# EAGLE design BTLED-01 (EAGLE 9.6.2)
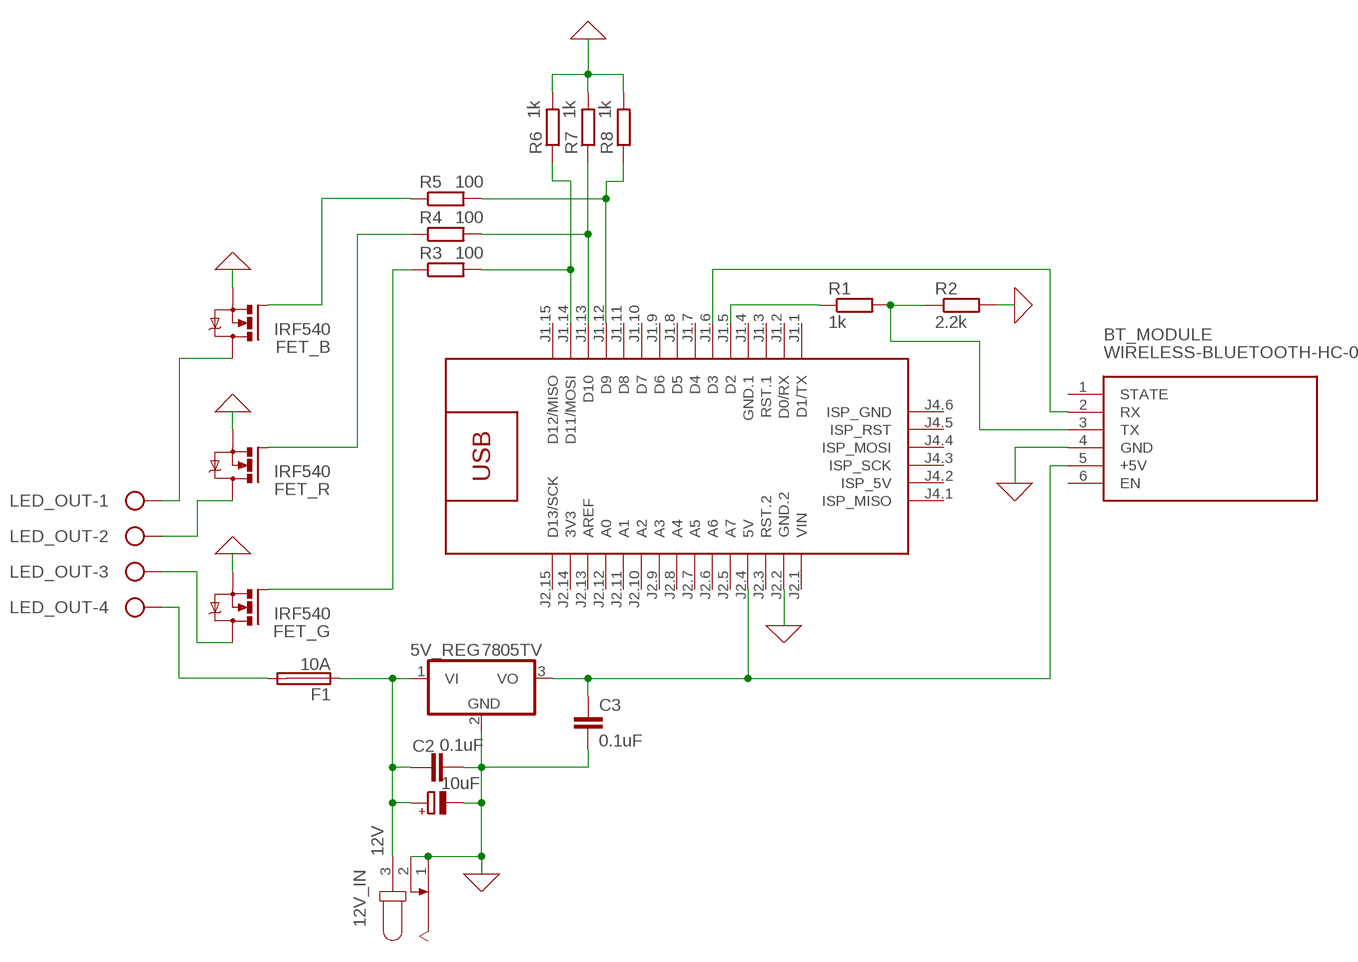
[diagram p0: schematic, sheet 1]

## Parts
5V_REG  7805TV  [TO220V]
12V_IN  12V  JACK-PLUG1  [SPC4078]
ARDUINO_NANO  ARDUINO-NANO-3.0#ISP  [ARDUINO-NANO-3.0#ISP]
BT_MODULE  WIRELESS-BLUETOOTH-HC-05  [WIRELESS-BLUETOOTH-HC-05]
C1  10uF  CPOL-EUE2.5-6  [E2,5-6]
C2  0.1uF  C-EU050-024X044  [C050-024X044]
C3  0.1uF  C-EU050-024X044  [C050-024X044]
F1  10A  SH22,5  [SH22,5]
FET_B  IRF540  [TO220BV]
FET_G  IRF540  [TO220BV]
FET_R  IRF540  [TO220BV]
LED_OUT  W237-4  [W237-4]
R1  1k  R-EU_0204/7  [0204/7]
R2  2.2k  R-EU_0204/7  [0204/7]
R3  100  R-EU_0204/7  [0204/7]
R4  100  R-EU_0204/7  [0204/7]
R5  100  R-EU_0204/7  [0204/7]
R6  1k  R-EU_0204/7  [0204/7]
R7  1k  R-EU_0204/7  [0204/7]
R8  1k  R-EU_0204/7  [0204/7]

## Nets
5V: 5V_REG.3(VO) ARDUINO_NANO.J2.4(5V) BT_MODULE.5(+5V) C3.1
12V_IN: 5V_REG.1(VI) 12V_IN.3 C1.+ C2.1 F1.1
12V_OUT: F1.2 LED_OUT.4
B_DRAIN: FET_B.D LED_OUT.1
B_SIG_1: ARDUINO_NANO.J1.12(D9) R5.2 R8.1
B_SIG_2: FET_B.G R5.1
BT_RX_3.3V: BT_MODULE.3(TX) R1.2 R2.1
BT_RX_5V: ARDUINO_NANO.J1.5(D2) R1.1
BT_TX: ARDUINO_NANO.J1.6(D3) BT_MODULE.2(RX)
G_DRAIN: FET_G.D LED_OUT.3
G_SIG_1: ARDUINO_NANO.J1.14(D11/MOSI) R3.2 R6.1
G_SIG_2: FET_G.G R3.1
GND: 5V_REG.2(GND) 12V_IN.1 12V_IN.2 ARDUINO_NANO.J2.2(GND.2) BT_MODULE.4(GND) C1.- C2.2 C3.2 FET_B.S FET_G.S FET_R.S R2.2 R6.2 R7.2 R8.2
R_DRAIN: FET_R.D LED_OUT.2
R_SIG_1: ARDUINO_NANO.J1.13(D10) R4.2 R7.1
R_SIG_2: FET_R.G R4.1
Unconnected: ARDUINO_NANO.J1.1(D1/TX) ARDUINO_NANO.J1.2(D0/RX) ARDUINO_NANO.J1.3(RST.1) ARDUINO_NANO.J1.7(D4) ARDUINO_NANO.J1.8(D5) ARDUINO_NANO.J1.9(D6) ARDUINO_NANO.J1.10(D7) ARDUINO_NANO.J1.11(D8) ARDUINO_NANO.J1.15(D12/MISO) ARDUINO_NANO.J2.3(RST.2) ARDUINO_NANO.J2.5(A7) ARDUINO_NANO.J2.6(A6) ARDUINO_NANO.J2.7(A5) ARDUINO_NANO.J2.8(A4) ARDUINO_NANO.J2.9(A3) ARDUINO_NANO.J2.10(A2) ARDUINO_NANO.J2.11(A1) ARDUINO_NANO.J2.12(A0) ARDUINO_NANO.J2.13(AREF) ARDUINO_NANO.J2.15(D13/SCK) ARDUINO_NANO.J4.1(ISP_MISO) ARDUINO_NANO.J4.2(ISP_5V) ARDUINO_NANO.J4.3(ISP_SCK) ARDUINO_NANO.J4.4(ISP_MOSI) ARDUINO_NANO.J4.5(ISP_RST) ARDUINO_NANO.J4.6(ISP_GND) BT_MODULE.1(STATE) BT_MODULE.6(EN)

## Power pins joined to a net without a drawn wire
3V3: ARDUINO_NANO.J2.14(3V3)
GND.1: ARDUINO_NANO.J1.4(GND.1)
VIN: ARDUINO_NANO.J2.1(VIN)

## Library data of the parts
5V_REG = linear:78*: Positive VOLTAGE REGULATOR Source: http://cache.national.com/ds/LM/LM78L05.pdf http://www.fairchildsemi.com/ds/LM/LM7805.pdf
12V_IN = con-jack:JACK-PLUG: DC POWER JACK Power Jack, DC, Right Angle, Through Hole, Rated 5A at 16VDC, PC Terminals Distributor: Farnell (www.Farnell.de) Drawing: 84N1161.pdf / 84N1162.pdf Manufacturer: SPC Technology (www.spctechnology.com) Type: SPC4077 / SPC 4078; OC_FARNELL: unknown; OC_NEWARK: unknown
ARDUINO_NANO = diy-modules:ARDUINO-NANO-3.0#ISP: Arduino Nano 3.0 (and compatible devices) with ISP pads More details available here: https://www.arduino.cc/en/Main/ArduinoBoardNano Click here to find device on ebay.com <http://www.ebay.com/sch/arduino+nano>
BT_MODULE = diy-modules:WIRELESS-BLUETOOTH-HC-05: Bluetooth Transceiver Module based on HC-05 board Tutorial is available here: https://arduino-info.wikispaces.com/BlueTooth-HC05-HC06-Modules-How-To Click here to find device on ebay.com <http://www.ebay.com/sch/hc-05+module+rs232>
C1 = rcl:CPOL-EU: POLARIZED CAPACITOR, European symbol; SPICEPREFIX: C
C2 C3 = rcl:C-EU: CAPACITOR, European symbol; SPICEPREFIX: C
F1 = fuse:SH22,5: FUSE HOLDER grid 22,5 mm, OGN0031 8201, Schurter (Buerklin); MF: SCHURTER; MPN: 0031.8201; OC_FARNELL: 1162740; OC_NEWARK: 96F8317
FET_B FET_G FET_R = transistor-power:IRF540: HEXFET Power MOSFET
LED_OUT = con-wago-500:W237-4: WAGO SCREW CLAMP; OC_FARNELL: unknown; OC_NEWARK: unknown
R1-R8 = rcl:R-EU_: RESISTOR, European symbol; SPICEPREFIX: R

## Net classes
0 default: width 0.305 mm, drill 0.61 mm, clearance 0.152 mm

## Board
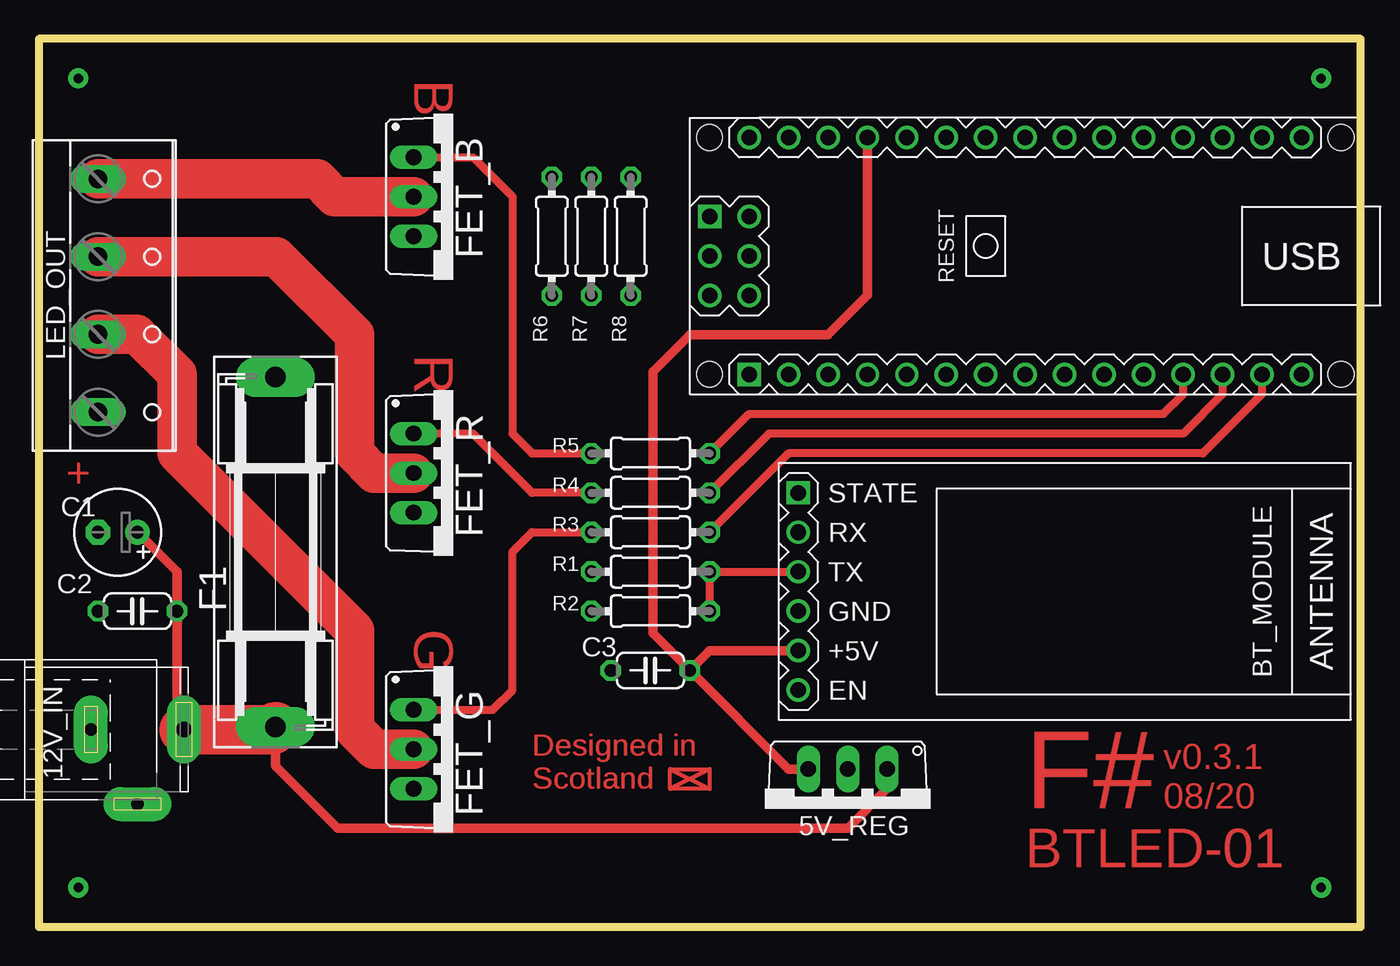
[diagram p1: board, top side]
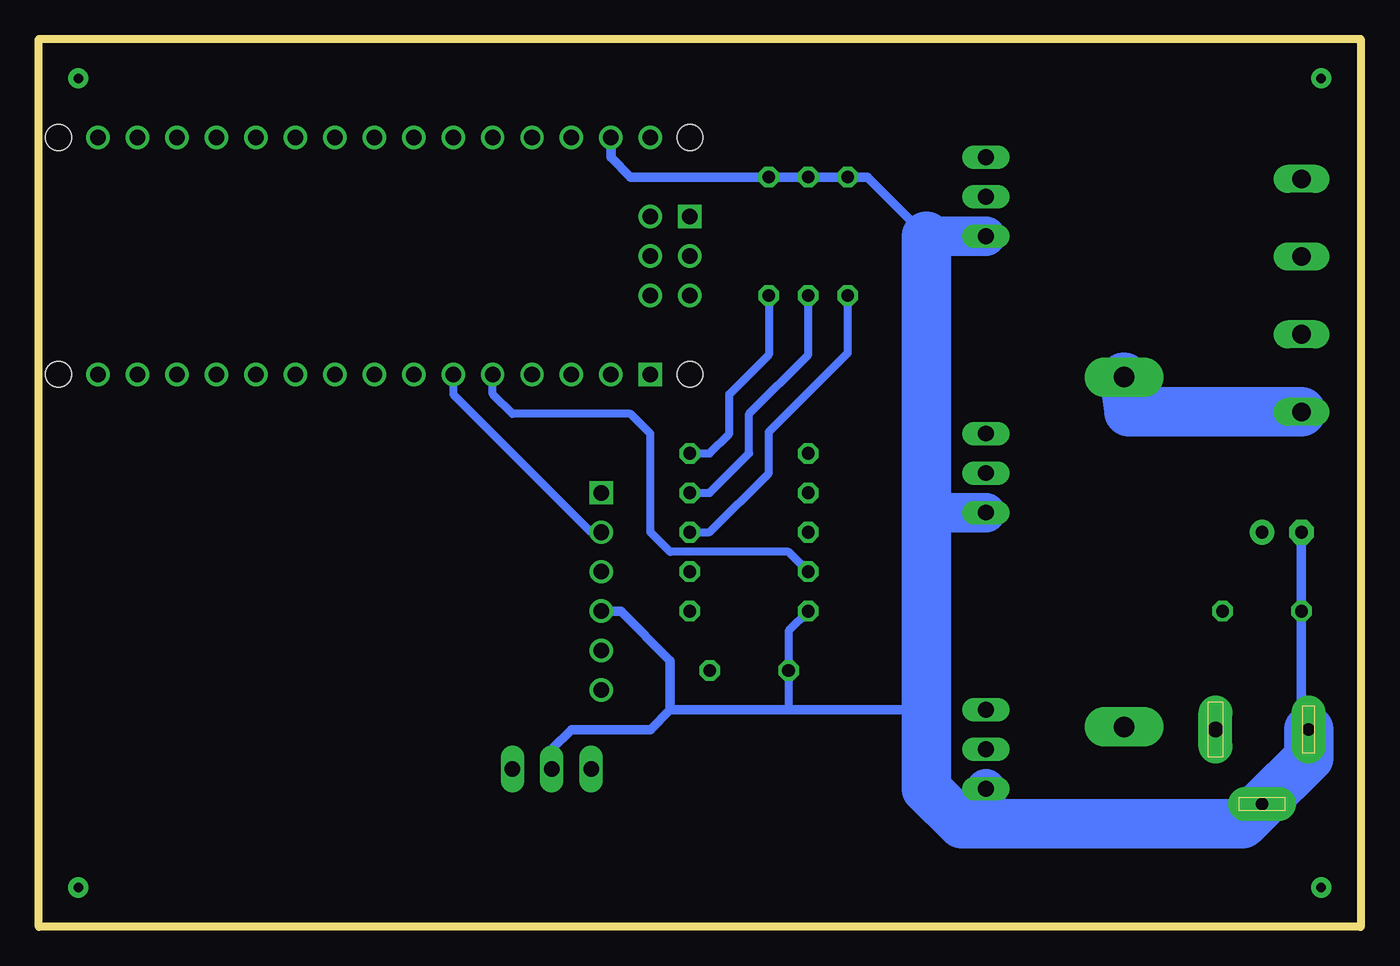
[diagram p2: board, bottom side, seen from below]

Size 85.09 x 57.15 mm. Coordinates in mm from the lower left corner, seen from the top.
Outline: 0,57.15 0,0 85.09,0 85.09,57.15 0,57.15
Copper layers (1*16): Top 0.035mm / dielectric 1.5mm / Bottom 0.035mm
Design rules "default *": minimum track width 6mil, minimum drill 0.35mm, track to track 4mil, track to pad 6mil, pad to pad 6mil, via to via 6mil, smd to smd 6mil, copper to edge 40mil, drill to drill 6mil, minimum pad ring 10mil, minimum via ring 8mil, stop-mask expansion 4mil, vias tented up to drill 0mil, thermal gap 10mil

### Footprints (pad centres in the part's own frame; a part is rotated, then mirrored left to right if it is on the bottom)
TO220V = drill 1.016 long: 1 -2.54,-2.54; 2 0,-2.54; 3 2.54,-2.54
SPC4078 = drill 0.8 pad 2.184 long: 1 -3,0; 2 0,-4.8 | drill 1 pad 2.184 long: 3 3,0
ARDUINO-NANO-3.0#ISP = drill 1 square: J1.1 17.78,7.62; J4.1 20.32,-2.54 | drill 1: J1.2 15.24,7.62; J1.3 12.7,7.62; J1.4 10.16,7.62; J1.5 7.62,7.62; J1.6 5.08,7.62; J1.7 2.54,7.62; J1.8 0,7.62; J1.9 -2.54,7.62; J1.10 -5.08,7.62; J1.11 -7.62,7.62; J1.12 -10.16,7.62; J1.13 -12.7,7.62; J1.14 -15.24,7.62; J1.15 -17.78,7.62; J2.1 17.78,-7.62; J2.2 15.24,-7.62; J2.3 12.7,-7.62; J2.4 10.16,-7.62; J2.5 7.62,-7.62; J2.6 5.08,-7.62; J2.7 2.54,-7.62; J2.8 0,-7.62; J2.9 -2.54,-7.62; J2.10 -5.08,-7.62; J2.11 -7.62,-7.62; J2.12 -10.16,-7.62; J2.13 -12.7,-7.62; J2.14 -15.24,-7.62; J2.15 -17.78,-7.62; J4.2 17.78,-2.54; J4.3 20.32,0; J4.4 17.78,0; J4.5 20.32,2.54; J4.6 17.78,2.54 | hole 1.651: -20.32,7.62; -20.32,-7.62; 20.32,-7.62; 20.32,7.62
WIRELESS-BLUETOOTH-HC-05 = drill 1 square: 1 -6.35,-17.145 | drill 1: 2 -3.81,-17.145; 3 -1.27,-17.145; 4 1.27,-17.145; 5 3.81,-17.145; 6 6.35,-17.145
E2,5-6 = drill 0.813 pad 1.6: + -1.27,0 | drill 0.813 pad 1.6 octagon: - 1.27,0
C050-024X044 = drill 0.813 octagon: 1 -2.54,0; 2 2.54,0
SH22,5 = drill 1.321 pad 2.54 long: 1 -11.252,0; 2 11.252,0
TO220BV = drill 1.016 long: D 0,-2.54; G -2.54,-2.54; S 2.54,-2.54
W237-4 = drill 1.194 long: 1 -7.5,-1.27; 2 -2.5,-1.27; 3 2.5,-1.27; 4 7.5,-1.27
0204/7 = drill 0.813 octagon: 1 -3.81,0; 2 3.81,0

### Placement (x,y rotation side)
5V_REG  52.07,7.62 180 top
12V_IN  6.35,12.7 0 top
ARDUINO_NANO  63.5,43.18 180 top
BT_MODULE  66.04,21.59 270 top
C1  5.08,25.4 180 top
C2  6.35,20.32 180 top
C3  39.37,16.51 180 top
F1  15.24,24.13 90 top
FET_B  26.67,46.99 270 top
FET_G  26.67,11.43 270 top
FET_R  26.67,29.21 270 top
LED_OUT  5.08,40.64 270 top
R1  39.37,22.86 0 top
R2  39.37,20.32 180 top
R3  39.37,25.4 0 top
R4  39.37,27.94 0 top
R5  39.37,30.48 0 top
R6  33.02,44.45 90 top
R7  35.56,44.45 90 top
R8  38.1,44.45 90 top

### Tracks (layer width: path | path; a pad name or v marks a point on that pad's centre or on a via)
5V
  Top 0.61: C3.1 39.53,18.89 39.53,35.72 41.91,38.1 50.8,38.1 53.34,40.64 ARDUINO_NANO.J2.4 | BT_MODULE.5 43.18,17.78 C3.1 | 5V_REG.3 48.26,10.16 C3.1
12V_IN
  Top 0.61: F1.1 15.24,10.34 19.23,6.35 52.07,6.35 54.61,8.89 5V_REG.1 | C1.+ 8.89,22.86 C2.1 8.89,13.16 12V_IN.3
  Top 3.175: 12V_IN.3 15.06,12.7 F1.1
12V_OUT
  Bottom 3.175: LED_OUT.4 14.93,33.14 F1.2
B_DRAIN
  Top 2.54: LED_OUT.1 17.9,48.14 19.05,46.99 FET_B.D
B_SIG_1
  Top 0.508: R5.2 45.72,33.02 72.39,33.02 73.66,34.29 ARDUINO_NANO.J1.12
  Bottom 0.508: R5.2 41.91,30.48 40.64,31.75 40.64,34.29 38.1,36.83 R8.1
B_SIG_2
  Top 0.508: FET_B.G 27.94,49.53 30.48,46.99 30.48,31.75 31.75,30.48 R5.1
BT_RX_3.3V
  Top 0.508: R2.1 R1.2 BT_MODULE.3
BT_RX_5V
  Bottom 0.508: R1.1 36.83,24.13 44.45,24.13 45.72,25.4 45.72,31.75 46.99,33.02 54.61,33.02 55.88,34.29 ARDUINO_NANO.J1.5
BT_TX
  Bottom 0.508: BT_MODULE.2 49.53,25.4 58.42,34.29 ARDUINO_NANO.J1.6
G_DRAIN
  Top 2.54: FET_G.D 21.59,11.43 20.32,12.7 20.32,19.05 8.89,30.48 8.89,35.56 6.31,38.14 LED_OUT.3
G_SIG_1
  Top 0.508: ARDUINO_NANO.J1.14 78.74,34.29 74.93,30.48 48.26,30.48 R3.2
  Bottom 0.508: R3.2 41.91,25.4 38.1,29.21 38.1,31.86 33.02,36.94 R6.1
G_SIG_2
  Top 0.508: FET_G.G 29.21,13.97 30.48,15.24 30.48,24.13 31.75,25.4 R3.1
GND
  Bottom 0.508: R2.2 36.83,19.05 C3.2 36.83,13.97
  Bottom 0.61: 27.94,13.97 36.83,13.97 44.45,13.97 | 27.94,44.45 31.75,48.26 R6.2 R7.2 R8.2 46.99,48.26 48.26,49.53 ARDUINO_NANO.J2.2 | 5V_REG.2 52.07,11.43 50.8,12.7 45.72,12.7 44.45,13.97 | BT_MODULE.4 47.62,20.32 44.45,17.14 44.45,13.97 | C1.- C2.2 3.81,13.16 12V_IN.1
  Bottom 2.54: FET_G.S 24.13,6.63 | FET_B.S 27.94,44.45 | FET_R.S 27.94,26.67
  Bottom 3.175: 27.94,44.45 27.94,26.67 27.94,13.97 27.94,8.89 25.68,6.63 24.13,6.63 7.62,6.63 12V_IN.2 3.35,10.9 12V_IN.1
N$1  (via drill 0.61 pad 1.3)
  other vias: 2.54,54.61
N$2  (via drill 0.61 pad 1.3)
  other vias: 2.54,2.54
N$3  (via drill 0.61 pad 1.3)
  other vias: 82.55,2.54
N$4  (via drill 0.61 pad 1.3)
  other vias: 82.55,54.61
N$5
  Top 0.254: 40.64,10.16 43.18,8.89 | 43.18,10.16 40.64,8.89 | 40.64,10.16 43.18,10.16 | 43.18,10.16 43.18,8.89 | 43.18,8.89 40.64,8.89 | 40.64,8.89 40.64,10.16
R_DRAIN
  Top 2.54: FET_R.D 21.59,29.21 20.32,30.48 20.32,38.1 15.28,43.14 LED_OUT.2
R_SIG_1
  Top 0.508: ARDUINO_NANO.J1.13 76.2,34.29 73.66,31.75 46.99,31.75 R4.2
  Bottom 0.508: R4.2 41.91,27.94 39.37,30.48 39.37,33.02 35.56,36.83 R7.1
R_SIG_2
  Top 0.508: R4.1 31.75,27.94 27.94,31.75 FET_R.G

### Text on the board
Top: B | R | + | G | v0.3.1 | Designed in / Scotland | Designed in / Scotland | F# | 08/20 | BTLED-01
_tNames: Q1 | U1 | LED_STRIP_OUT | LED_STRIP_OUT | Q1 | Q2 | Q2 | R5 | R4 | C1 | R3 | C1 | R1 | U$2 | C2 | C2 | F1 | F1 | R2 | IC1 | Q3 | IC1 | Q3 | C3 | C3 | J1 | J1